# Altium project LM2587.PrjPcb
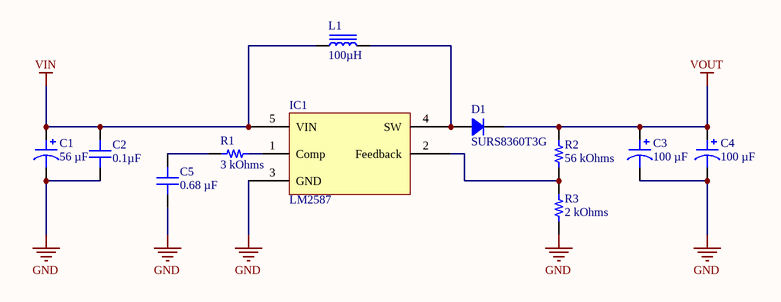
[diagram p0: LM2587.SchDoc]
1 sheet, 11 parts. Net scope: global (net labels, ports and power ports of the same name join across sheets).
Board file: LM2587.PcbDoc

## Sheet LM2587.SchDoc
size A4; SheetNumber: 1; SheetTotal: 1

### Parts
C1  56 µF  [CAP ALSMD 6.6MM H7.7MM]
C2  0.1µF  [CAP 0805_2012]
C3  100 µF  [CAP ALSMD 8.3MM H10.5MM]
C4  100 µF  [CAP ALSMD 8.3MM H10.5MM]
C5  0.68 µF  [CAP 0805_2012]
D1  SURS8360T3G  [DO214AB SMC]
IC1  LM2587  [D2PAK]
L1  100µH  [7447070]
R1  3 kOhms  [RES 0805_2012]
R2  56 kOhms  [RES 0805_2012]
R3  2 kOhms  [RES 0805_2012]

### Nets
GND: C1.2 C2.1 C3.2 C4.2 C5.1 IC1.3(GND) R3.1
VIN: C1.1 C2.2 IC1.5(VIN) L1.1
VOUT: C3.1 C4.1 D1.2 R2.2
NetC5_2: C5.2 R1.1
NetD1_1: D1.1 IC1.4(SW) L1.2
NetIC1_1: IC1.1(Comp) R1.2
NetIC1_2: IC1.2(Feedback) R2.1 R3.2

### Library data of the parts
C1 = UWD1V560MCL1GS: CAP ALUM 56UF 20% 35V SMD; manufacturer: Nichicon; Impedance: 340 mOhms; Lifetime @ Temp.: 2000 Hrs @ 105°C; Polarization: Polar; Ripple Current @ High Frequency: 280 mA @ 100 kHz; Ripple Current @ Low Frequency: 140 mA @ 120 Hz; Surface Mount Land Size: 0.260" L x 0.260" W (6.60mm x 6.60mm); Part Number: UWD1V560MCL1GS; Applications: General Purpose; Capacitance: 56 µF; componentlink1description: Datasheet; componentlink1url: http://nichicon-us.com/english/products/pdfs/e-uwd.pdf; componentlink2description: DigiKey Link; componentlink2url: https://www.digikey.com/en/products/detail/nichicon/UWD1V560MCL1GS/2550638; Device Package: Radial, Can - SMD; Height - Seated (Max): 0.303" (7.70mm); lastupdated: 3.06.2024 20:16:18; Lifecycle Status: Active; Minimum Order: 1; Mounting Type: Surface Mount; Operating Temperature: -55°C ~ 105°C; Package / Case: Radial, Can - SMD; packaging: TapeAndReel; partid: 28126; Part Status: Active; price: 0.13; series: UWD; Size / Dimension: 0.248" Dia (6.30mm); Supplier 1: DigiKey; Supplier Part Number 1: 493-9694-1-ND; Tolerance: ±20%; value: 56 µF; Voltage - Rated: 35 V
C2 = MM055C104KCZ2A: CAP CER 0.1UF 50V X7R 0805; manufacturer: AVX Corporation; Tolerance: ±10%; Part Number: MM055C104KCZ2A; Capacitance: 0.1µF; Applications: Medical, Non-Critical; componentlink1description: Datasheet; componentlink1url: http://datasheets.avx.com/AVX-MM.pdf; componentlink2description: DigiKey Link; componentlink2url: http://digikey.com/product-detail/en/avx-corporation/MM055C104KCZ2A/478-10639-1-ND/7344900; Device Package: 0805 (2012 Metric); lastupdated: 2.09.2020 01:04:13; Lifecycle Status: Active; Minimum Order: 1; Mounting Type: Surface Mount, MLCC; Operating Temperature: -55°C ~ 125°C; Package / Case: 0805 (2012 Metric); packaging: TapeAndReel; partid: 16381; Part Status: Active; price: 0.45; series: MM; Size / Dimension: 0.079" L x 0.049" W (2.01mm x 1.25mm); Supplier 1: DigiKey; Supplier Part Number 1: 478-10639-1-ND; Temperature Coefficient: X7R; Thickness (Max): 0.029" (0.74mm); value: 0.1µF; Voltage - Rated: 50V
C3 C4 = EEE-FK1H101P: CAP ALUM 100UF 20% 50V SMD; manufacturer: Panasonic Electronic Components; Impedance: 340 mOhms; Lifetime @ Temp.: 2000 Hrs @ 105°C; Polarization: Polar; Ripple Current @ High Frequency: 350 mA @ 100 kHz; Ripple Current @ Low Frequency: 262.5 mA @ 120 Hz; Surface Mount Land Size: 0.327" L x 0.327" W (8.30mm x 8.30mm); Part Number: EEE-FK1H101P; Applications: Automotive; Capacitance: 100 µF; componentlink2description: DigiKey Link; componentlink2url: https://www.digikey.com/en/products/detail/panasonic-electronic-components/EEE-FK1H101P/765978; Device Package: Radial, Can - SMD; Height - Seated (Max): 0.413" (10.50mm); lastupdated: 3.06.2024 20:15:48; Lifecycle Status: Active; Minimum Order: 1; Mounting Type: Surface Mount; Operating Temperature: -55°C ~ 105°C; Package / Case: Radial, Can - SMD; packaging: TapeAndReel; partid: 7485; Part Status: Active; price: 0.22; Ratings: AEC-Q200; series: FK; Size / Dimension: 0.315" Dia (8.00mm); Supplier 1: DigiKey; Supplier Part Number 1: PCE3809CT-ND; Tolerance: ±20%; value: 100 µF; Voltage - Rated: 50 V
C5 = C0805C684K5RACAUTO7210: CAP CER 0.68UF 50V X7R 0805; manufacturer: KEMET; Tolerance: ±10%; Part Number: C0805C684K5RACAUTO7210; Capacitance: 0.68 µF; Applications: Automotive, Bypass, Decoupling; componentlink1description: Datasheet; componentlink1url: https://api.kemet.com/component-edge/download/datasheet/C0805C684K5RACAUTO7210.pdf; componentlink2description: DigiKey Link; componentlink2url: https://www.digikey.com/en/products/detail/kemet/C0805C684K5RACAUTO7210/11676953; Device Package: 0805 (2012 Metric); lastupdated: 9.02.2024 20:15:07; Lifecycle Status: Active; Minimum Order: 1; Mounting Type: Surface Mount, MLCC; Operating Temperature: -55°C ~ 125°C; Package / Case: 0805 (2012 Metric); packaging: TapeAndReel; partid: 32222; Part Status: Active; price: 0.05; Ratings: AEC-Q200; series: SMD Auto X7R; Size / Dimension: 0.079" L x 0.049" W (2.00mm x 1.25mm); Supplier 1: DigiKey; Supplier Part Number 1: 399-C0805C684K5RACAUTO7210CT-ND; Temperature Coefficient: X7R; Thickness (Max): 0.057" (1.45mm); value: 0.68 µF; Voltage - Rated: 50V
D1 = SURS8360T3G: DIODE GEN PURP 600V 3A SMC; Manufacturer: ON Semiconductor; Current - Reverse Leakage @ Vr: 10µA @ 600V; Diode Type: Standard; Reverse Recovery Time (trr): 75ns; Speed: Fast Recovery =< 500ns, > 200mA (Io); Voltage - Forward (Vf) (Max) @ If: 1.25V @ 3A; Part Number: SURS8360T3G; ComponentLink1Description: Datasheet; ComponentLink1URL: http://www.onsemi.com/pub/Collateral/MURS320T3-D.PDF; ComponentLink2Description: DigiKey Link; ComponentLink2URL: http://digikey.com/product-detail/en/on-semiconductor/SURS8360T3G/SURS8360T3GOSCT-ND/9087771; Current - Average Rectified (Io): 3A; LastUpdated: 3.06.2024 19:54:15; Lifecycle Status: Active; Minimum Order: 1; Mounting Type: Surface Mount; Operating Temperature - Junction: -65°C ~ 175°C; Package / Case: DO-214AB, SMC; Packaging: TapeAndReel; PartId: 348; Part Status: Active; Price: 0.30; Series: -; Supplier 1: DigiKey; Supplier Part Number 1: SURS8360T3GOSCT-ND; Supplier Device Package: SMC; Voltage - DC Reverse (Vr) (Max): 600V
IC1 = LM2587: Boost
L1 = SLF7032T-101MR45-2PF: FIXED IND 100UH 450MA 540 MOHM; Manufacturer: TDK Corporation; DC Resistance (DCR): 540mOhm Max; Inductance Frequency - Test: 100kHz; Material - Core: Ferrite; Shielding: Shielded; Tolerance: ±20%; Type: Wirewound; Part Number: SLF7032T-101MR45-2PF; ComponentLink1Description: Datasheet; ComponentLink1URL: //media.digikey.com/pdf/Data%20Sheets/TDK%20PDFs/SLF7032_Type.pdf; ComponentLink2Description: DigiKey Link; ComponentLink2URL: http://digikey.com/product-detail/en/tdk-corporation/SLF7032T-101MR45-2PF/445-1999-1-ND/755406; Current Rating (Amps): 450mA; Device Package: Nonstandard; Height - Seated (Max): 0.134" (3.40mm); Inductance: 100µH; LastUpdated: 2.09.2020 01:30:23; Lifecycle Status: Active; Minimum Order: 1; Mounting Type: Surface Mount; Operating Temperature: -40°C ~ 105°C; Package / Case: Nonstandard; Packaging: TapeAndReel; PartId: 3668; Part Status: Active; Price: 0.43; Series: SLF; Size / Dimension: 0.276" L x 0.276" W (7.00mm x 7.00mm); Supplier 1: DigiKey; Supplier Part Number 1: 445-1999-1-ND; Value: 100µH
R1 = TNPW08053K00BYEN: RES 3K OHM 0.1% 1/8W 0805; Manufacturer: Vishay Dale; Power (Watts): 0.125W, 1/8W; Temperature Coefficient: ±10ppm/°C; Part Number: TNPW08053K00BYEN; Value: 3 kOhms; ComponentLink1Description: Datasheet; ComponentLink1URL: https://www.vishay.com/docs/28758/tnpw_e3.pdf; ComponentLink2Description: DigiKey Link; ComponentLink2URL: https://www.digikey.com/en/products/detail/vishay-dale/TNPW08053K00BYEN/7658636; Composition: Thin Film; Device Package: 0805 (2012 Metric); Features: Anti-Sulfur, Automotive AEC-Q200, Moisture Resistant; Height - Seated (Max): 0.022" (0.55mm); LastUpdated: 8.02.2024 20:59:56; Lifecycle Status: Active; Minimum Order: 1; Number of Terminations: 2; Operating Temperature: -55°C ~ 155°C; Package / Case: 0805 (2012 Metric); Packaging: TapeAndReel; PartId: 80167; Price: 0.29; Ratings: AEC-Q200; Resistance: 3 kOhms; Series: TNPW e3; Size / Dimension: 0.079" L x 0.049" W (2.00mm x 1.25mm); Supplier 1: DigiKey; Supplier Part Number 1: 541-TNPW08053K00BYENCT-ND; Supplier Device Package: 0805; Tolerance: ±0.1%
R2 = RMCF0805FT56K0: RES 56K OHM 1% 1/8W 0805; Manufacturer: Stackpole Electronics Inc; Power (Watts): 0.125W, 1/8W; Temperature Coefficient: ±100ppm/°C; Part Number: RMCF0805FT56K0; Value: 56 kOhms; ComponentLink1Description: Datasheet; ComponentLink1URL: https://www.seielect.com/catalog/sei-packaging.pdf; ComponentLink2Description: DigiKey Link; ComponentLink2URL: https://www.digikey.com/en/products/detail/stackpole-electronics-inc/RMCF0805FT56K0/1760366; Composition: Thick Film; Device Package: 0805 (2012 Metric); Features: Automotive AEC-Q200; Height - Seated (Max): 0.026" (0.65mm); LastUpdated: 8.02.2024 21:02:18; Lifecycle Status: Active; Minimum Order: 1; Number of Terminations: 2; Operating Temperature: -55°C ~ 155°C; Package / Case: 0805 (2012 Metric); Packaging: CutTape; PartId: 32591; Part Status: Active; Price: 0.01; Ratings: AEC-Q200; Resistance: 56 kOhms; Series: RMCF; Size / Dimension: 0.079" L x 0.049" W (2.00mm x 1.25mm); Supplier 1: DigiKey; Supplier Part Number 1: RMCF0805FT56K0CT-ND; Supplier Device Package: 0805; Tolerance: ±1%
R3 = TNPW08052K00FEEA: RES 2K OHM 1% 1/8W 0805; Manufacturer: Vishay Dale; Power (Watts): 0.125W, 1/8W; Temperature Coefficient: ±25ppm/°C; Part Number: TNPW08052K00FEEA; Value: 2 kOhms; ComponentLink1Description: Datasheet; ComponentLink1URL: http://www.vishay.com/docs/28758/tnpw_e3.pdf; ComponentLink2Description: DigiKey Link; ComponentLink2URL: https://www.digikey.com/en/products/detail/vishay-dale/TNPW08052K00FEEA/7354893; Composition: Thin Film; Device Package: 0805 (2012 Metric); Features: Anti-Sulfur, Automotive AEC-Q200, Moisture Resistant; Height - Seated (Max): 0.022" (0.55mm); LastUpdated: 8.02.2024 21:02:13; Lifecycle Status: Active; Minimum Order: 1; Number of Terminations: 2; Operating Temperature: -55°C ~ 155°C; Package / Case: 0805 (2012 Metric); Packaging: TapeAndReel; PartId: 33621; Part Status: Active; Price: 0.05; Ratings: AEC-Q200; Resistance: 2 kOhms; Series: TNPW e3; Size / Dimension: 0.079" L x 0.049" W (2.00mm x 1.25mm); Supplier 1: DigiKey; Supplier Part Number 1: 541-3918-1-ND; Supplier Device Package: 0805; Tolerance: ±1%